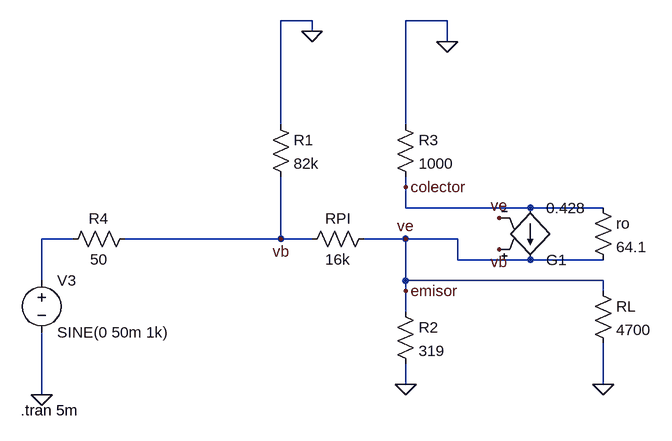
[diagram p0: schematic DiseñoCircuitoTL2MPS.asc]
DiseñoCircuitoTL2MPS.asc, the LTspice schematic file:
Version 4
SHEET 1 880 680
WIRE 96 -112 48 -112
WIRE 304 -112 240 -112
WIRE 96 -96 96 -112
WIRE 304 -80 304 -112
WIRE 48 48 48 -112
WIRE 240 48 240 -112
WIRE 240 144 240 128
WIRE 240 176 240 144
WIRE 432 176 240 176
WIRE 544 176 432 176
WIRE -272 224 -320 224
WIRE 48 224 48 128
WIRE 48 224 -192 224
WIRE 96 224 48 224
WIRE 240 224 176 224
WIRE 320 224 240 224
WIRE 320 256 320 224
WIRE 432 256 320 256
WIRE 544 256 432 256
WIRE -320 288 -320 224
WIRE 240 288 240 224
WIRE 544 288 240 288
WIRE 240 304 240 288
WIRE 544 304 544 288
WIRE 240 336 240 304
WIRE 240 448 240 416
WIRE 544 448 544 384
WIRE -320 464 -320 368
FLAG 240 448 0
FLAG 96 -96 0
FLAG 304 -80 0
FLAG 240 144 colector
FLAG 240 304 emisor
FLAG 48 224 vb
FLAG 384 240 vb
FLAG 240 224 ve
FLAG 384 192 ve
FLAG -320 464 0
FLAG 544 448 0
SYMBOL res 32 32 R0
SYMATTR InstName R1
SYMATTR Value 82k
SYMBOL res 224 320 R0
SYMATTR InstName R2
SYMATTR Value 319
SYMBOL res 224 32 R0
SYMATTR InstName R3
SYMATTR Value 1000
SYMBOL voltage -320 272 R0
WINDOW 123 0 0 Left 0
WINDOW 39 0 0 Left 0
SYMATTR InstName V3
SYMATTR Value SINE(0 50m 1k)
SYMBOL res -176 208 R90
WINDOW 0 0 56 VBottom 2
WINDOW 3 32 56 VTop 2
SYMATTR InstName R4
SYMATTR Value 50
SYMBOL res 192 208 R90
WINDOW 0 0 56 VBottom 2
WINDOW 3 32 56 VTop 2
SYMATTR InstName RPI
SYMATTR Value 16k
SYMBOL g 432 272 M180
SYMATTR InstName G1
SYMATTR Value 0.428
SYMBOL res 528 160 R0
SYMATTR InstName ro
SYMATTR Value 64.1
SYMBOL res 528 288 R0
SYMATTR InstName RL
SYMATTR Value 4700
TEXT -352 488 Left 2 !.tran 5m

The netlist it stands for:
* DiseñoCircuitoTL2MPS.asc
R1 0 vb 82k
R2 ve 0 319
R3 0 colector 1000
V3 N001 0 SINE(0 50m 1k)
R4 vb N001 50
RPI ve vb 16k
G1 colector ve vb ve 0.428
ro colector ve 64.1
RL ve 0 4700
.tran 5m
.backanno
.end